# EAGLE design P2P_1 (EAGLE 6.5.0)

## Sheet 1 of 2
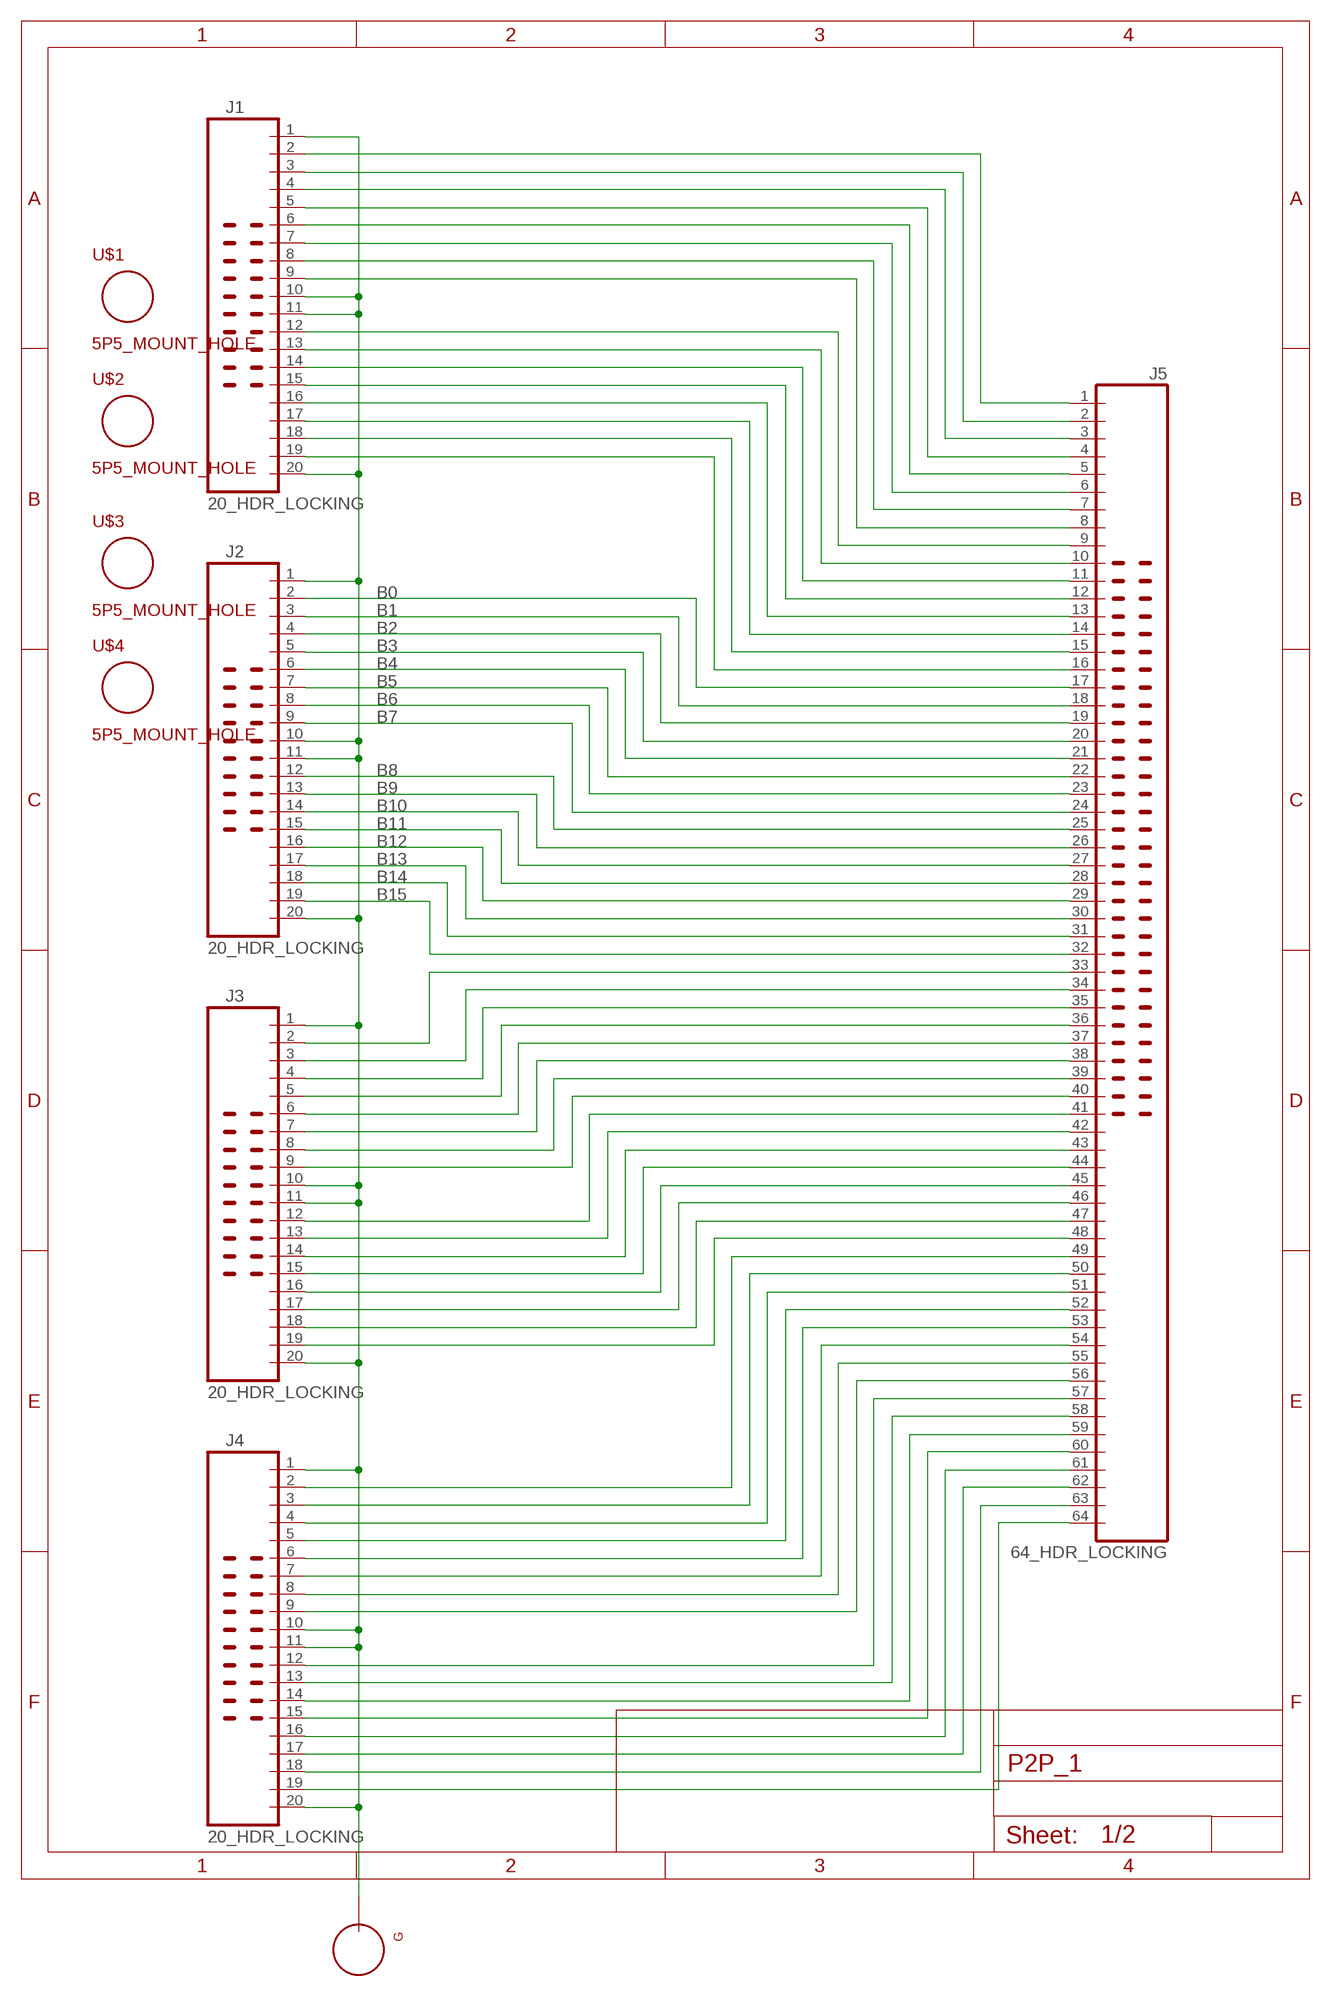
[diagram p0: schematic, sheet 1]

### Parts
G  TEST_LOOP  [TEST_LOOP]
J1  20_HDR_LOCKING  [20_HDR_LOCKING]
J2  20_HDR_LOCKING  [20_HDR_LOCKING]
J3  20_HDR_LOCKING  [20_HDR_LOCKING]
J4  20_HDR_LOCKING  [20_HDR_LOCKING]
J5  64_HDR_LOCKING  [64_HDR_LOCKING]
U$1  5P5_MOUNT_HOLE  [5P5M_HOLE]
U$2  5P5_MOUNT_HOLE  [5P5M_HOLE]
U$3  5P5_MOUNT_HOLE  [5P5M_HOLE]
U$4  5P5_MOUNT_HOLE  [5P5M_HOLE]

### Nets
B0: J2.2 J5.17 ; also sheet 2
B1: J2.3 J5.18 ; also sheet 2
B2: J2.4 J5.19 ; also sheet 2
B3: J2.5 J5.20 ; also sheet 2
B4: J2.6 J5.21 ; also sheet 2
B5: J2.7 J5.22 ; also sheet 2
B6: J2.8 J5.23 ; also sheet 2
B7: J2.9 J5.24 ; also sheet 2
B8: J2.12 J5.25 ; also sheet 2
B9: J2.13 J5.26 ; also sheet 2
B10: J2.14 J5.27 ; also sheet 2
B11: J2.15 J5.28 ; also sheet 2
B12: J2.16 J5.29 ; also sheet 2
B13: J2.17 J5.30 ; also sheet 2
B14: J2.18 J5.31 ; also sheet 2
B15: J2.19 J5.32 ; also sheet 2
N$5: G.P$1 J1.1 J1.10 J1.11 J1.20 J2.1 J2.10 J2.11 J2.20 J3.1 J3.10 J3.11 J3.20 J4.1 J4.10 J4.11 J4.20
N$18: J3.2 J5.33
N$19: J3.3 J5.34
N$20: J3.4 J5.35
N$21: J3.5 J5.36
N$22: J3.6 J5.37
N$23: J3.7 J5.38
N$24: J3.8 J5.39
N$25: J3.9 J5.40
N$26: J3.12 J5.41
N$27: J3.13 J5.42
N$28: J3.14 J5.43
N$29: J3.15 J5.44
N$30: J3.16 J5.45
N$31: J3.17 J5.46
N$32: J3.18 J5.47
N$33: J3.19 J5.48
N$34: J4.2 J5.49
N$35: J4.3 J5.50
N$36: J4.4 J5.51
N$37: J4.5 J5.52
N$38: J4.6 J5.53
N$39: J4.7 J5.54
N$40: J4.8 J5.55
N$41: J4.9 J5.56
N$42: J1.19 J5.16
N$43: J1.18 J5.15
N$44: J1.17 J5.14
N$45: J1.16 J5.13
N$46: J1.15 J5.12
N$47: J1.14 J5.11
N$48: J1.13 J5.10
N$49: J1.12 J5.9
N$50: J1.9 J5.8
N$51: J1.8 J5.7
N$52: J1.7 J5.6
N$53: J1.6 J5.5
N$54: J1.5 J5.4
N$55: J1.4 J5.3
N$56: J1.3 J5.2
N$57: J1.2 J5.1
N$58: J4.12 J5.57
N$59: J4.13 J5.58
N$60: J4.14 J5.59
N$61: J4.15 J5.60
N$62: J4.16 J5.61
N$63: J4.17 J5.62
N$64: J4.18 J5.63
N$65: J4.19 J5.64

## Sheet 2 of 2
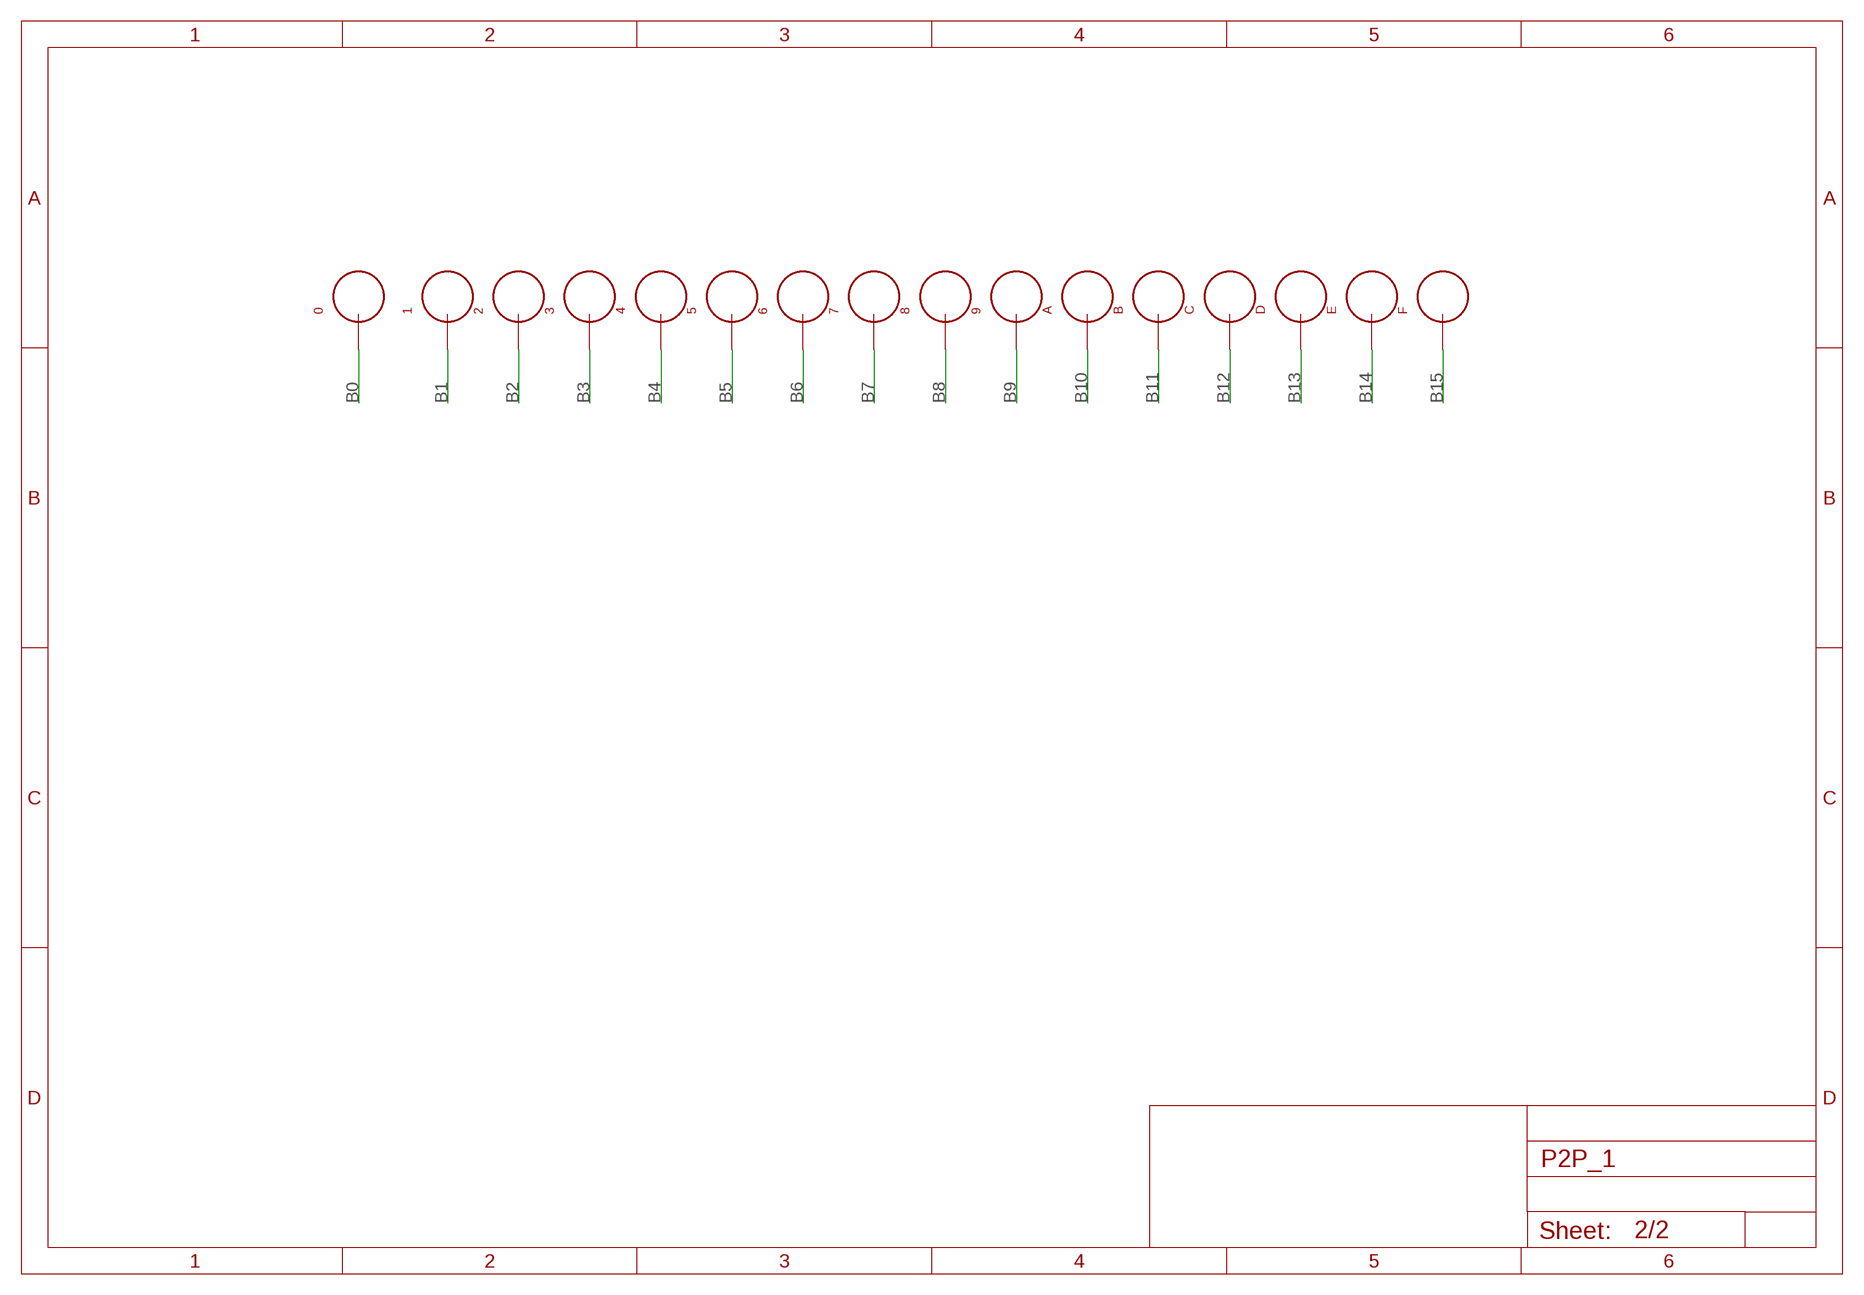
[diagram p1: schematic, sheet 2]

### Parts
0  TEST_LOOP  [TEST_LOOP]
1  TEST_LOOP  [TEST_LOOP]
2  TEST_LOOP  [TEST_LOOP]
3  TEST_LOOP  [TEST_LOOP]
4  TEST_LOOP  [TEST_LOOP]
5  TEST_LOOP  [TEST_LOOP]
6  TEST_LOOP  [TEST_LOOP]
7  TEST_LOOP  [TEST_LOOP]
8  TEST_LOOP  [TEST_LOOP]
9  TEST_LOOP  [TEST_LOOP]
A  TEST_LOOP  [TEST_LOOP]
B  TEST_LOOP  [TEST_LOOP]
C  TEST_LOOP  [TEST_LOOP]
D  TEST_LOOP  [TEST_LOOP]
E  TEST_LOOP  [TEST_LOOP]
F  TEST_LOOP  [TEST_LOOP]

### Nets
B0: 0.P$1 ; also sheet 1
B1: 1.P$1 ; also sheet 1
B2: 2.P$1 ; also sheet 1
B3: 3.P$1 ; also sheet 1
B4: 4.P$1 ; also sheet 1
B5: 5.P$1 ; also sheet 1
B6: 6.P$1 ; also sheet 1
B7: 7.P$1 ; also sheet 1
B8: 8.P$1 ; also sheet 1
B9: 9.P$1 ; also sheet 1
B10: A.P$1 ; also sheet 1
B11: B.P$1 ; also sheet 1
B12: C.P$1 ; also sheet 1
B13: D.P$1 ; also sheet 1
B14: E.P$1 ; also sheet 1
B15: F.P$1 ; also sheet 1

## Library data of the parts
0 1-9 A B C D E F G = MyLib:TEST_LOOP
J1-J4 = MyLib:20_HDR_LOCKING
J5 = MyLib:64_HDR_LOCKING
U$1-U$4 = MyLib:5P5_MOUNT_HOLE

## Board
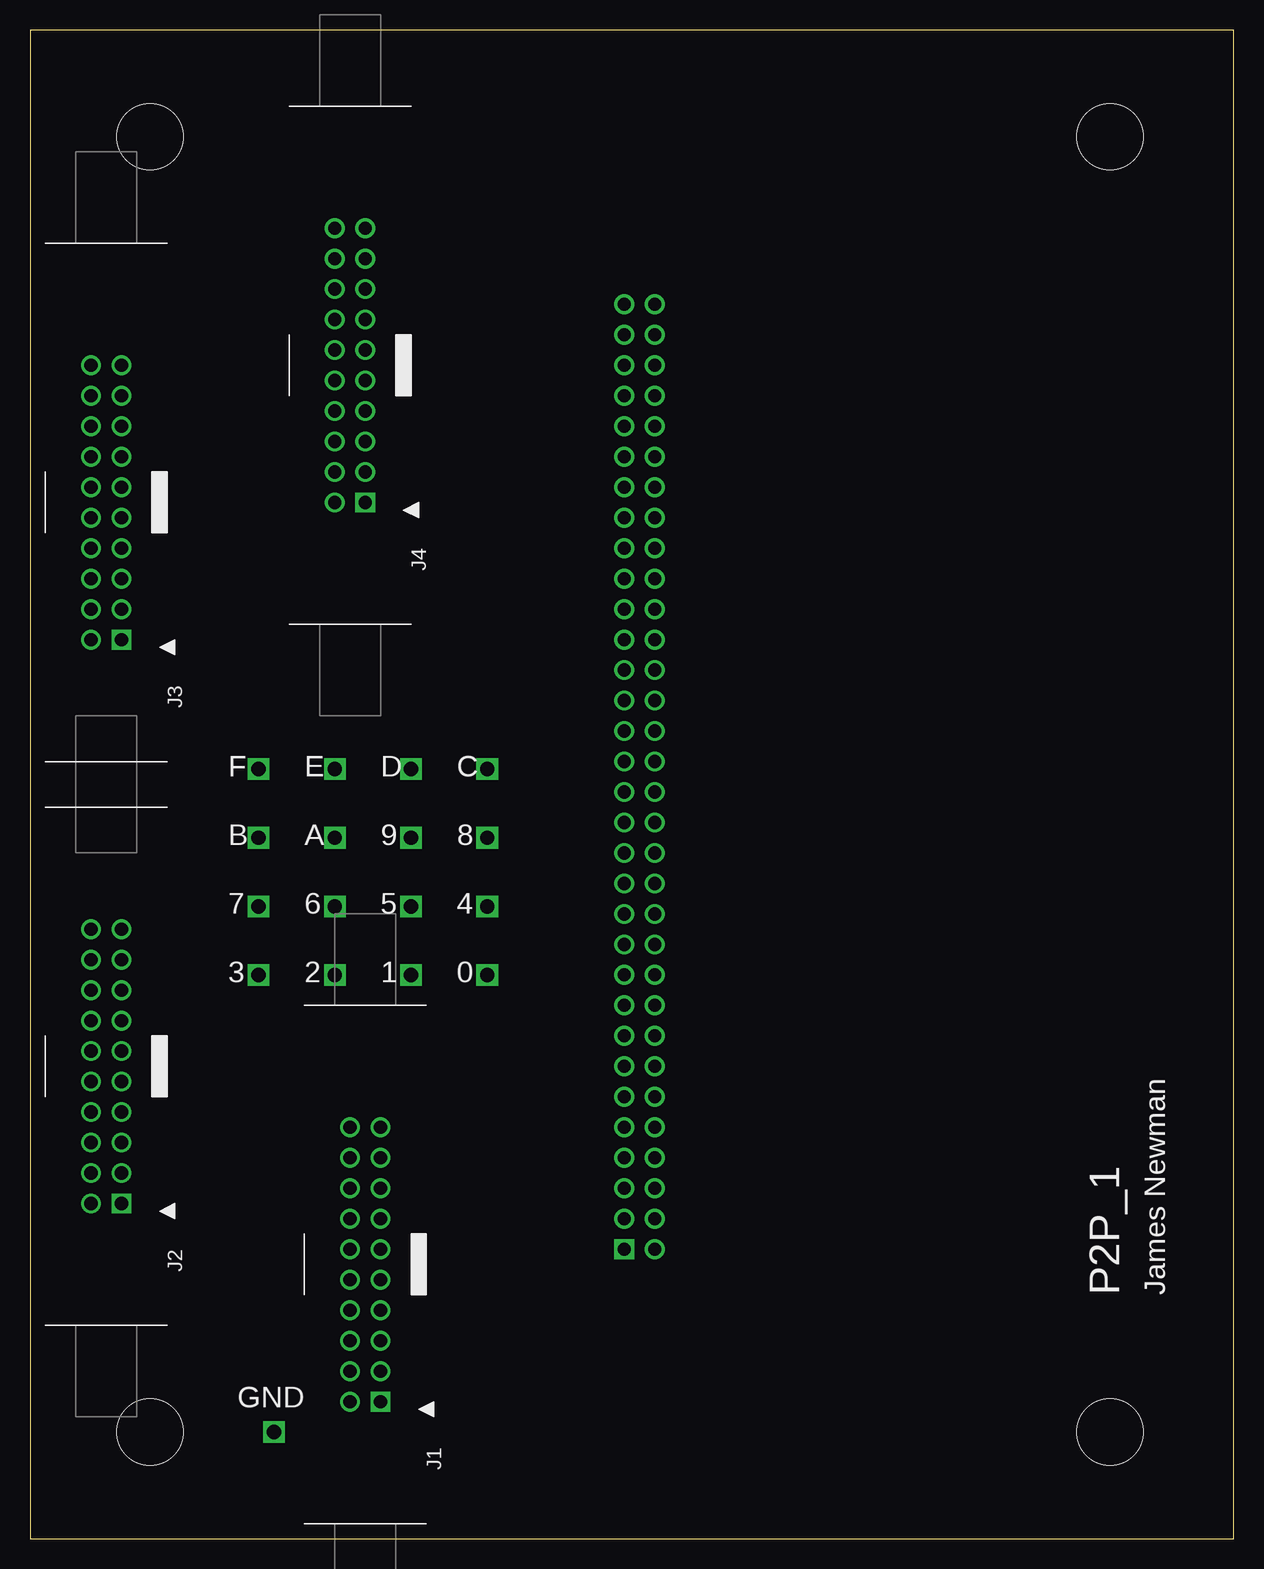
[diagram p2: board, top side]
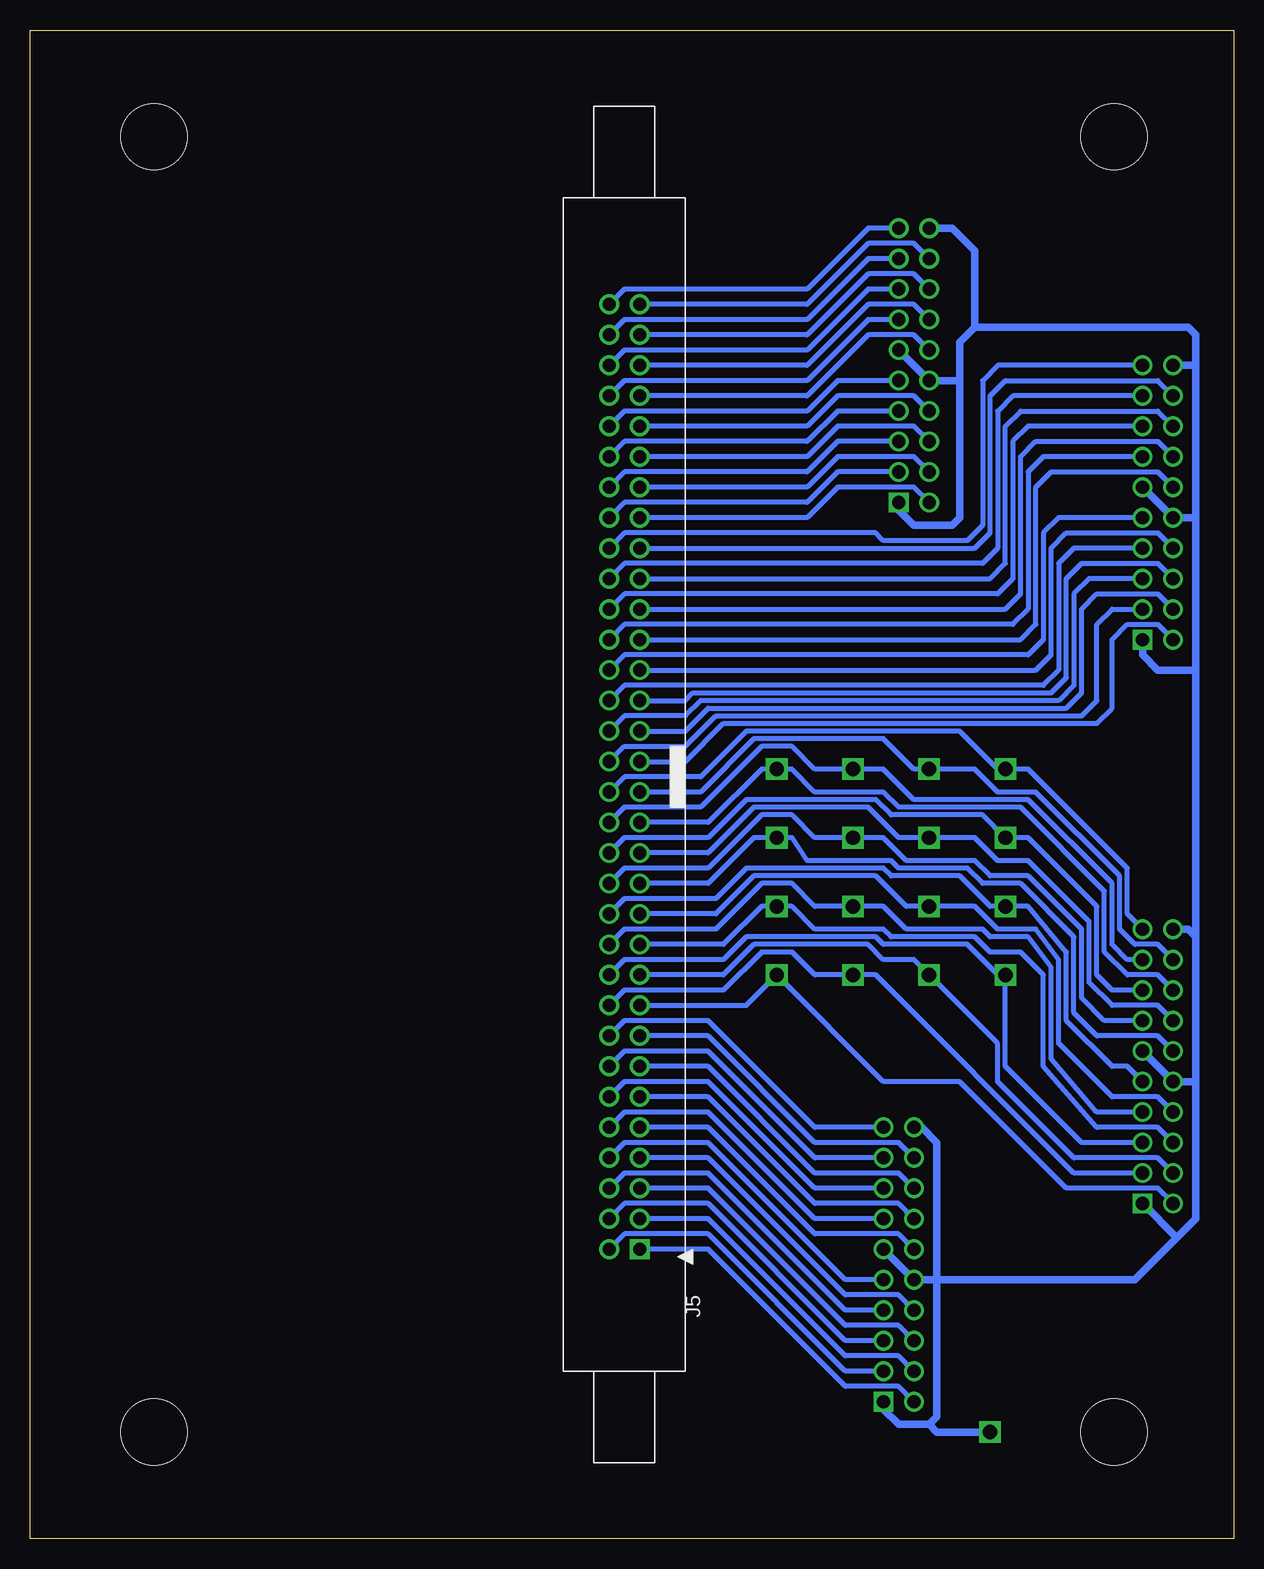
[diagram p3: board, bottom side, seen from below]

Size 100.33 x 125.73 mm. Coordinates in mm from the lower left corner, seen from the top.
Outline: 100.33,125.73 0,125.73 0,0 100.33,0 100.33,125.73
Copper layers (1*16): Top 0.035mm / dielectric 1.5mm / Bottom 0.035mm
Design rules "processor_rules_2layer": minimum track width 8mil, minimum drill 14mil, track to track 8mil, track to pad 8mil, pad to pad 8mil, via to via 8mil, smd to smd 8mil, copper to edge 40mil, drill to drill 8mil, minimum pad ring 10mil, minimum via ring 8mil, stop-mask expansion 4mil, vias tented up to drill 0mil, thermal gap 10mil

### Footprints (pad centres in the part's own frame; a part is rotated, then mirrored left to right if it is on the bottom)
TEST_LOOP = drill 1.2 square: P$1 0,0
20_HDR_LOCKING = drill 1.1 square: 1 -1.27,11.43 | drill 1.1: 2 1.27,11.43; 3 -1.27,8.89; 4 1.27,8.89; 5 -1.27,6.35; 6 1.27,6.35; 7 -1.27,3.81; 8 1.27,3.81; 9 -1.27,1.27; 10 1.27,1.27; 11 -1.27,-1.27; 12 1.27,-1.27; 13 -1.27,-3.81; 14 1.27,-3.81; 15 -1.27,-6.35; 16 1.27,-6.35; 17 -1.27,-8.89; 18 1.27,-8.89; 19 -1.27,-11.43; 20 1.27,-11.43
64_HDR_LOCKING = drill 1.1 square: 1 -39.37,-1.27 | drill 1.1: 2 -39.37,1.27; 3 -36.83,-1.27; 4 -36.83,1.27; 5 -34.29,-1.27; 6 -34.29,1.27; 7 -31.75,-1.27; 8 -31.75,1.27; 9 -29.21,-1.27; 10 -29.21,1.27; 11 -26.67,-1.27; 12 -26.67,1.27; 13 -24.13,-1.27; 14 -24.13,1.27; 15 -21.59,-1.27; 16 -21.59,1.27; 17 -19.05,-1.27; 18 -19.05,1.27; 19 -16.51,-1.27; 20 -16.51,1.27; 21 -13.97,-1.27; 22 -13.97,1.27; 23 -11.43,-1.27; 24 -11.43,1.27; 25 -8.89,-1.27; 26 -8.89,1.27; 27 -6.35,-1.27; 28 -6.35,1.27; 29 -3.81,-1.27; 30 -3.81,1.27; 31 -1.27,-1.27; 32 -1.27,1.27; 33 1.27,-1.27; 34 1.27,1.27; 35 3.81,-1.27; 36 3.81,1.27; 37 6.35,-1.27; 38 6.35,1.27; 39 8.89,-1.27; 40 8.89,1.27; 41 11.43,-1.27; 42 11.43,1.27; 43 13.97,-1.27; 44 13.97,1.27; 45 16.51,-1.27; 46 16.51,1.27; 47 19.05,-1.27; 48 19.05,1.27; 49 21.59,-1.27; 50 21.59,1.27; 51 24.13,-1.27; 52 24.13,1.27; 53 26.67,-1.27; 54 26.67,1.27; 55 29.21,-1.27; 56 29.21,1.27; 57 31.75,-1.27; 58 31.75,1.27; 59 34.29,-1.27; 60 34.29,1.27; 61 36.83,-1.27; 62 36.83,1.27; 63 39.37,-1.27; 64 39.37,1.27
5P5M_HOLE = hole 5.5: 0,0

### Placement (x,y rotation side)
0  38.1,46.99 90 top
1  31.75,46.99 90 top
2  25.4,46.99 90 top
3  19.05,46.99 90 top
4  38.1,52.7 90 top
5  31.75,52.7 90 top
6  25.4,52.7 90 top
7  19.05,52.7 90 top
8  38.1,58.42 90 top
9  31.75,58.42 90 top
A  25.4,58.42 90 top
B  19.05,58.42 90 top
C  38.1,64.14 90 top
D  31.75,64.14 90 top
E  25.4,64.14 90 top
F  19.05,64.14 90 top
G  20.32,8.89 0 top
J1  27.94,22.86 180 top
J2  6.35,39.37 180 top
J3  6.35,86.36 180 top
J4  26.67,97.79 180 top
J5  50.8,63.5 90 bottom
U$1  90,8.89 180 top
U$2  90,116.84 180 top
U$3  10,116.84 0 top
U$4  10,8.89 180 top

### Tracks (layer width: path | path; a pad name or v marks a point on that pad's centre or on a via)
B0
  Bottom 0.406: J2.2 6.35,29.21 13.97,29.21 22.86,38.1 29.21,38.1 0.P$1 40.64,44.45 J5.17
B1
  Bottom 0.406: J2.3 13.34,30.48 29.84,46.99 1.P$1 34.92,46.99 36.83,48.9 39.37,48.9 42.55,45.72 50.8,45.72 J5.18
B2
  Bottom 0.406: J2.4 6.35,31.75 13.34,31.75 19.68,38.1 19.68,41.27 2.P$1 26.67,48.26 29.21,48.26 30.48,49.53 40.01,49.53 42.55,46.99 J5.19
B3
  Bottom 0.406: J2.5 12.7,33.02 19.05,39.37 3.P$1 19.68,46.99 22.23,49.53 29.21,49.53 29.84,50.16 40.64,50.16 42.55,48.26 50.8,48.26 J5.20
B4
  Bottom 0.406: J2.6 6.35,34.29 11.43,34.29 15.88,39.37 15.88,46.99 17.78,48.9 20.32,48.9 21.59,50.16 28.57,50.16 29.21,50.8 34.92,50.8 36.83,52.7 4.P$1 39.37,52.7 42.55,49.53 J5.21
B5
  Bottom 0.406: J2.7 11.43,35.56 15.24,40.01 15.24,47.62 17.14,50.16 20.32,50.16 20.95,50.8 27.3,50.8 29.21,52.7 5.P$1 34.92,52.7 36.83,54.61 39.37,54.61 43.18,50.8 50.8,50.8 J5.22
B6
  Bottom 0.406: J2.8 6.35,36.83 10.16,36.83 14.61,41.27 14.61,48.26 16.51,50.8 19.68,50.8 21.59,52.7 6.P$1 27.3,52.7 29.84,55.24 40.01,55.24 43.18,52.07 J5.23
B7
  Bottom 0.406: J2.9 8.89,39.37 10.16,39.37 13.97,43.18 13.97,48.9 17.14,52.7 7.P$1 20.32,52.7 22.86,55.24 28.57,55.24 29.21,55.88 40.64,55.88 43.18,53.34 50.8,53.34 J5.24
B8
  Bottom 0.406: J2.12 6.35,41.91 11.43,41.91 13.34,43.81 13.34,50.16 17.78,54.61 20.95,54.61 22.23,55.88 27.94,55.88 28.57,56.52 35.56,56.52 36.83,58.42 8.P$1 40.01,58.42 43.81,54.61 J5.25
B9
  Bottom 0.406: J2.13 10.79,43.18 12.7,45.09 12.7,50.8 17.14,55.24 20.32,55.24 21.59,56.52 27.3,56.52 29.21,58.42 9.P$1 34.92,58.42 36.83,60.33 39.37,60.33 43.81,55.88 50.8,55.88 J5.26
B10
  Bottom 0.406: J2.14 6.35,44.45 10.16,44.45 12.06,46.35 12.06,51.44 17.14,56.52 19.68,56.52 21.59,58.42 A.P$1 27.94,58.42 30.48,60.96 40.01,60.96 43.81,57.15 J5.27
B11
  Bottom 0.406: J2.15 10.16,45.72 11.43,46.99 11.43,52.7 17.14,58.42 B.P$1 20.95,60.33 28.57,60.33 29.84,61.59 40.64,61.59 43.81,58.42 50.8,58.42 J5.28
B12
  Bottom 0.406: J2.16 6.35,46.99 8.89,46.99 10.79,48.9 10.79,53.98 17.78,60.96 27.94,60.96 29.21,62.23 34.92,62.23 36.83,64.14 C.P$1 39.37,64.14 43.81,59.69 J5.29
B13
  Bottom 0.406: J2.17 8.89,48.26 10.16,49.53 10.16,54.61 17.14,61.59 26.67,61.59 29.21,64.14 D.P$1 34.92,64.14 36.83,66.04 39.37,66.04 44.45,60.96 50.8,60.96 J5.30
B14
  Bottom 0.406: J2.18 6.35,49.53 8.26,49.53 9.53,50.8 9.53,55.24 16.51,62.23 19.68,62.23 21.59,64.14 E.P$1 26.67,64.14 29.21,66.67 40.01,66.67 44.45,62.23 J5.31
B15
  Bottom 0.406: J2.19 8.89,52.07 8.89,55.88 17.14,64.14 F.P$1 19.68,64.14 22.86,67.31 40.64,67.31 44.45,63.5 50.8,63.5 J5.32
N$5
  Bottom 0.61: J4.1 27.94,85.72 26.67,84.45 23.5,84.45 22.86,85.09 22.86,96.52 | 22.86,96.52 22.86,99.69 21.59,100.97 | 21.59,100.97 3.81,100.97 3.17,100.33 3.17,97.79 | 3.17,97.79 3.17,85.09 | 3.17,85.09 3.17,72.39 | 3.17,72.39 3.17,50.16 | 3.17,50.16 3.17,38.1 | 3.17,38.1 3.17,26.67 4.76,25.08 | 4.76,25.08 8.26,21.59 24.77,21.59 | 24.77,21.59 J1.10 J1.11 | J2.1 4.76,25.08 | 3.17,38.1 J2.10 J2.11 | J1.20 26.04,34.29 24.77,33.02 24.77,21.59 | J1.1 29.21,10.79 27.94,9.53 25.4,9.53 | 25.4,9.53 24.77,10.16 24.77,21.59 | J3.1 7.62,73.66 6.35,72.39 3.17,72.39 | 3.17,85.09 J3.10 J3.11 | J3.20 3.17,97.79 | 22.86,96.52 J4.10 J4.11 | J4.20 23.5,109.22 21.59,107.31 21.59,100.97 | J2.20 3.81,50.8 3.17,50.16 | G.P$1 24.77,8.89 25.4,9.53
N$18
  Bottom 0.406: J5.33 45.72,64.77 42.55,67.94 11.43,67.94 10.16,69.22 10.16,74.93 8.89,76.2 6.35,76.2 J3.2
N$19
  Bottom 0.406: J5.34 50.8,66.04 45.72,66.04 43.18,68.58 12.7,68.58 11.43,69.85 11.43,76.2 10.16,77.47 J3.3
N$20
  Bottom 0.406: J5.35 45.72,67.31 43.81,69.22 13.97,69.22 12.7,70.48 12.7,77.47 11.43,78.74 6.35,78.74 J3.4
N$21
  Bottom 0.406: J3.5 12.06,80.01 13.34,78.74 13.34,71.12 14.61,69.85 44.45,69.85 45.72,68.58 50.8,68.58 J5.36
N$22
  Bottom 0.406: J5.37 45.72,69.85 45.09,70.48 15.24,70.48 13.97,71.75 13.97,80.01 12.7,81.28 6.35,81.28 J3.6
N$23
  Bottom 0.406: J3.7 13.34,82.55 14.61,81.28 14.61,72.39 15.88,71.12 50.8,71.12 J5.38
N$24
  Bottom 0.406: J5.39 16.51,72.39 15.24,73.66 15.24,82.55 13.97,83.82 6.35,83.82 J3.8
N$25
  Bottom 0.406: J3.9 14.61,85.09 15.88,83.82 15.88,74.93 17.14,73.66 50.8,73.66 J5.40
N$26
  Bottom 0.406: J5.41 17.78,74.93 16.51,76.2 16.51,87.63 15.24,88.9 6.35,88.9 J3.12
N$27
  Bottom 0.406: J3.13 15.88,90.17 17.14,88.9 17.14,77.47 18.41,76.2 50.8,76.2 J5.42
N$28
  Bottom 0.406: J5.43 19.05,77.47 17.78,78.74 17.78,90.17 16.51,91.44 6.35,91.44 J3.14
N$29
  Bottom 0.406: J3.15 17.14,92.71 18.41,91.44 18.41,80.01 19.68,78.74 50.8,78.74 J5.44
N$30
  Bottom 0.406: J5.45 20.32,80.01 19.05,81.28 19.05,92.71 17.78,93.98 6.35,93.98 J3.16
N$31
  Bottom 0.406: J3.17 18.41,95.25 19.68,93.98 19.68,82.55 20.95,81.28 50.8,81.28 J5.46
N$32
  Bottom 0.406: J5.47 21.59,82.55 20.32,83.82 20.32,95.25 19.05,96.52 6.35,96.52 J3.18
N$33
  Bottom 0.406: J3.19 19.68,97.79 20.95,96.52 20.95,84.45 22.23,83.19 29.21,83.19 29.84,83.82 50.8,83.82 J5.48
N$34
  Bottom 0.406: J4.2 26.67,87.63 33.02,87.63 35.56,85.09 J5.49
N$35
  Bottom 0.406: J4.3 33.02,88.9 35.56,86.36 50.8,86.36 J5.50
N$36
  Bottom 0.406: J4.4 26.67,90.17 33.02,90.17 35.56,87.63 J5.51
N$37
  Bottom 0.406: J4.5 33.02,91.44 35.56,88.9 50.8,88.9 J5.52
N$38
  Bottom 0.406: J4.6 26.67,92.71 33.02,92.71 35.56,90.17 J5.53
N$39
  Bottom 0.406: J4.7 33.02,93.98 35.56,91.44 50.8,91.44 J5.54
N$40
  Bottom 0.406: J4.8 26.67,95.25 33.02,95.25 35.56,92.71 J5.55
N$41
  Bottom 0.406: J4.9 33.02,96.52 35.56,93.98 50.8,93.98 J5.56
N$42
  Bottom 0.406: J1.19 34.92,34.29 43.81,43.18 50.8,43.18 J5.16
N$43
  Bottom 0.406: J1.18 27.94,33.02 34.92,33.02 43.81,41.91 J5.15
N$44
  Bottom 0.406: J1.17 34.92,31.75 43.81,40.64 50.8,40.64 J5.14
N$45
  Bottom 0.406: J1.16 27.94,30.48 34.92,30.48 43.81,39.37 J5.13
N$46
  Bottom 0.406: J1.15 34.92,29.21 43.81,38.1 50.8,38.1 J5.12
N$47
  Bottom 0.406: J1.14 27.94,27.94 34.92,27.94 43.81,36.83 J5.11
N$48
  Bottom 0.406: J1.13 34.92,26.67 43.81,35.56 50.8,35.56 J5.10
N$49
  Bottom 0.406: J1.12 27.94,25.4 34.92,25.4 43.81,34.29 J5.9
N$50
  Bottom 0.406: J1.9 32.38,21.59 43.81,33.02 50.8,33.02 J5.8
N$51
  Bottom 0.406: J1.8 27.94,20.32 32.38,20.32 43.81,31.75 J5.7
N$52
  Bottom 0.406: J1.7 32.38,19.05 43.81,30.48 50.8,30.48 J5.6
N$53
  Bottom 0.406: J1.6 27.94,17.78 32.38,17.78 43.81,29.21 J5.5
N$54
  Bottom 0.406: J1.5 32.38,16.51 43.81,27.94 50.8,27.94 J5.4
N$55
  Bottom 0.406: J1.4 27.94,15.24 32.38,15.24 43.81,26.67 J5.3
N$56
  Bottom 0.406: J1.3 32.38,13.97 43.81,25.4 50.8,25.4 J5.2
N$57
  Bottom 0.406: J1.2 27.94,12.7 32.38,12.7 43.81,24.13 J5.1
N$58
  Bottom 0.406: J4.12 26.67,100.33 30.48,100.33 35.56,95.25 J5.57
N$59
  Bottom 0.406: J4.13 30.48,101.6 35.56,96.52 50.8,96.52 J5.58
N$60
  Bottom 0.406: J4.14 26.67,102.87 30.48,102.87 35.56,97.79 J5.59
N$61
  Bottom 0.406: J4.15 30.48,104.14 35.56,99.06 50.8,99.06 J5.60
N$62
  Bottom 0.406: J4.16 26.67,105.41 30.48,105.41 35.56,100.33 J5.61
N$63
  Bottom 0.406: J4.17 30.48,106.68 35.56,101.6 50.8,101.6 J5.62
N$64
  Bottom 0.406: J4.18 26.67,107.95 30.48,107.95 35.56,102.87 J5.63
N$65
  Bottom 0.406: J4.19 30.48,109.22 35.56,104.14 50.8,104.14 J5.64

### Text on the board
tPlace: F | E | D | C | B | A | 9 | 8 | 7 | 6 | 5 | 4 | 3 | 2 | 1 | 0 | P2P_1 | James Newman | GND